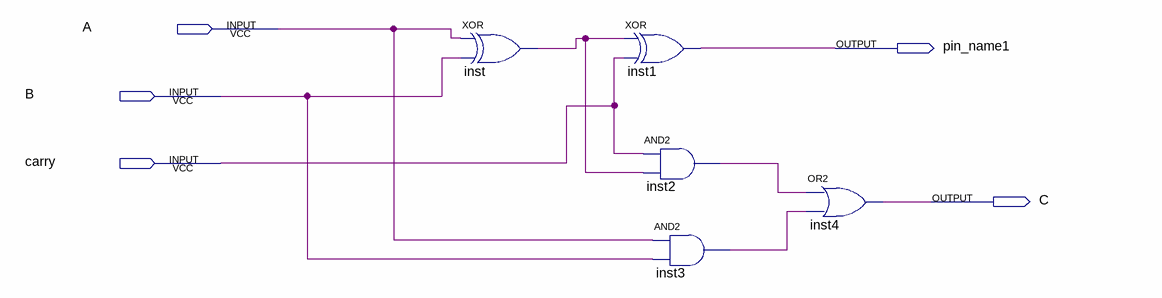
[diagram p0: schematic sheet]
// Quartus schematic fullA.bdf as structural Verilog: 5 symbols, 5 pins
module fullA (
  input  A,
  input  B,
  input  carry,
  output pin_name1,
  output C
);

  wire inst2_out, inst3_out, inst_out;

  xor inst (inst_out, A, B);
  xor inst1 (pin_name1, inst_out, carry);
  and inst2 (inst2_out, carry, inst_out);
  and inst3 (inst3_out, A, B);
  or inst4 (C, inst2_out, inst3_out);
endmodule
